# Altium project sensor.PrjPCB
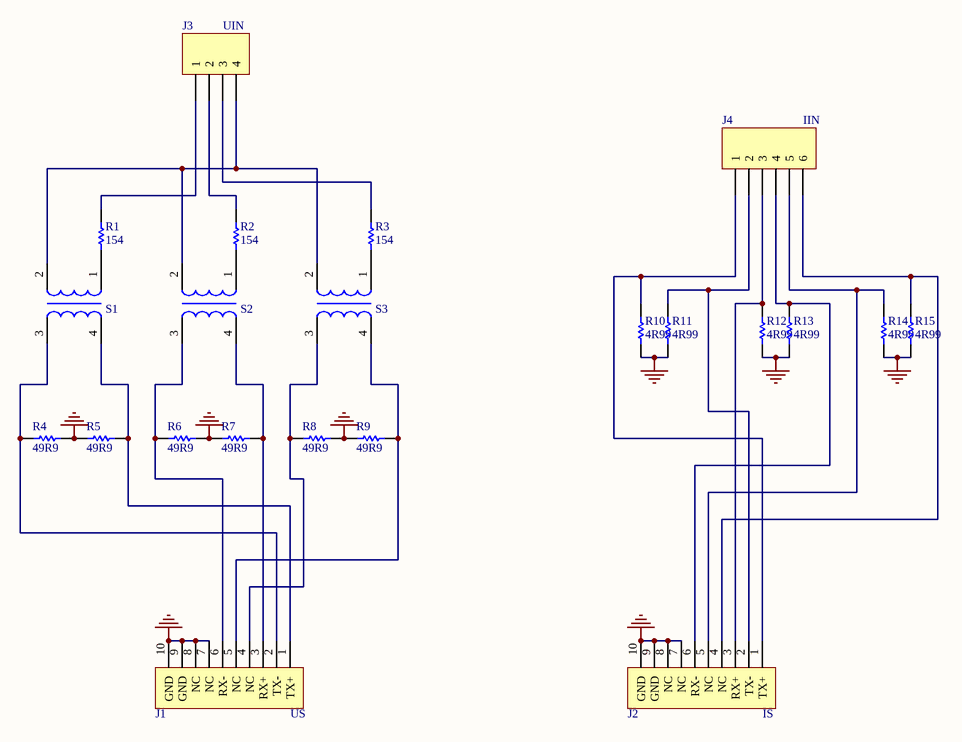
[diagram p0: sensor.SchDoc]
1 sheet, 22 parts. Net scope: global (net labels, ports and power ports of the same name join across sheets).
Board file: sensor.PcbDoc

## Sheet sensor.SchDoc
size A4

### Parts
J1  US  [RJ-45]
J2  IS  [RJ-45]
J3  UIN  [2EDG-3.81-4P]
J4  IIN  [2EDG-3.81-6P]
R1  154  [R1W]
R2  154  [R1W]
R3  154  [R1W]
R4  49R9  [0805]
R5  49R9  [0805]
R6  49R9  [0805]
R7  49R9  [0805]
R8  49R9  [0805]
R9  49R9  [0805]
R10  4R99  [0805]
R11  4R99  [0805]
R12  4R99  [0805]
R13  4R99  [0805]
R14  4R99  [0805]
R15  4R99  [0805]
S1  US  [US]  (value not drawn)
S2  US  [US]  (value not drawn)
S3  US  [US]  (value not drawn)

### Nets
GND: J1.7(NC) J1.8(NC) J1.9(GND) J1.10(GND) J2.7(NC) J2.8(NC) J2.9(GND) J2.10(GND) R4.1 R5.2 R6.1 R7.2 R8.1 R9.2 R10.1 R11.1 R12.1 R13.1 R14.1 R15.1
NetJ1_1: J1.1(TX+) R5.1 S1.4
NetJ1_2: J1.2(TX-) R4.2 S1.3
NetJ1_3: J1.3(RX+) R7.1 S2.4
NetJ1_4: J1.4(NC) R8.2 S3.3
NetJ1_5: J1.5(NC) R9.1 S3.4
NetJ1_6: J1.6(RX-) R6.2 S2.3
NetJ2_1: J2.1(TX+) J4.1 R10.2
NetJ2_2: J2.2(TX-) J4.2 R11.2
NetJ2_3: J2.3(RX+) J4.3 R12.2
NetJ2_4: J2.4(NC) J4.6 R15.2
NetJ2_5: J2.5(NC) J4.5 R14.2
NetJ2_6: J2.6(RX-) J4.4 R13.2
NetJ3_1: J3.1 R1.2
NetJ3_2: J3.2 R2.2
NetJ3_3: J3.3 R3.2
NetJ3_4: J3.4 S1.2 S2.2 S3.2
NetR1_1: R1.1 S1.1
NetR2_1: R2.1 S2.1
NetR3_1: R3.1 S3.1

### Library data of the parts
J1 J2 = RJ45: RJ45水晶座
J3 = MHDR1X4: Header, 4-Pin; LatestRevisionDate: 17-Jul-2002; LatestRevisionNote: Re-released for DXP Platform.; Publisher: Altium Limited
J4 = MHDR1X6: Header, 6-Pin; LatestRevisionDate: 17-Jul-2002; LatestRevisionNote: Re-released for DXP Platform.; Publisher: Altium Limited
R1-R3 = Res: 电阻; Published: 8-Jun-2000; LatestRevisionDate: 17-Jul-2002; LatestRevisionNote: Re-released for DXP Platform.; Publisher: Altium Limited
R4-R15 = Res: Resistor; Published: 8-Jun-2000; LatestRevisionDate: 17-Jul-2002; LatestRevisionNote: Re-released for DXP Platform.; Publisher: Altium Limited
S1-S3 = US: 电压互感器